# Altium schematic sheet LEDs.SchDoc
size A
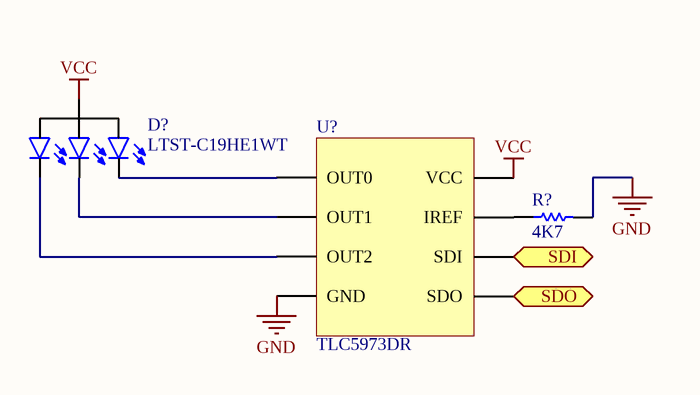
[diagram p0: LEDs.SchDoc]

## Parts
D?  LTST-C19HE1WT  [LED0606]
R?  value 4K7  [R0402[1005]]  (hidden comment: 4K7 1% 0402)
U?  TLC5973DR  [SOIC-8]

## Ports
SDI (in), SDO (out)

## Nets
GND: R?.1 U?.4(GND)
VCC: D?.4(A) U?.8(VCC)
SDI: U?.6(SDI) ; port SDI
SDO: U?.5(SDO) ; port SDO
NetD?_1: D?.1(K_Red) U?.1(OUT0)
NetD?_2: D?.2(K_Green) U?.2(OUT1)
NetD?_3: D?.3(K_Blue) U?.3(OUT2)
NetR?_2: R?.2 U?.7(IREF)

## Library data of the parts
D? = LTST-C19HE1WT: Manufacturer: Lite-On Inc.; PartNumber: LTST-C19HE1WT; PackageReference: 0606; Mounting Technology: Surface Mount; PackageDescription: 0606 (1616 Metric)
R? = RES_4K7_0402_1%: 4K7 0.063W 1% 0402 (1005 Metric); Manufacturer: KOA Speer; PartNumber: RK73H1ETTP4701F; Tolerance: 1%; Power: 0.063W; Mounting Technology: Surface Mount; PackageReference: 0402; PackageDescription: 0402 (1005 Metric); ComponentLink1Description: Datasheet; ComponentLink1URL: http://www.koaspeer.com/catimages/Products/RK73H/RK73H.pdf
U? = TLC5973DR: LED Lighting Drivers 3Ch 12B PWM Constant Crnt LED Dvr; Manufacturer: Texas Instruments; PartNumber: TLC5973DR; Mounting Technology: Surface Mount; PackageReference: SOIC-8